# Altium project MotorControllerBoardV2.PrjPcb
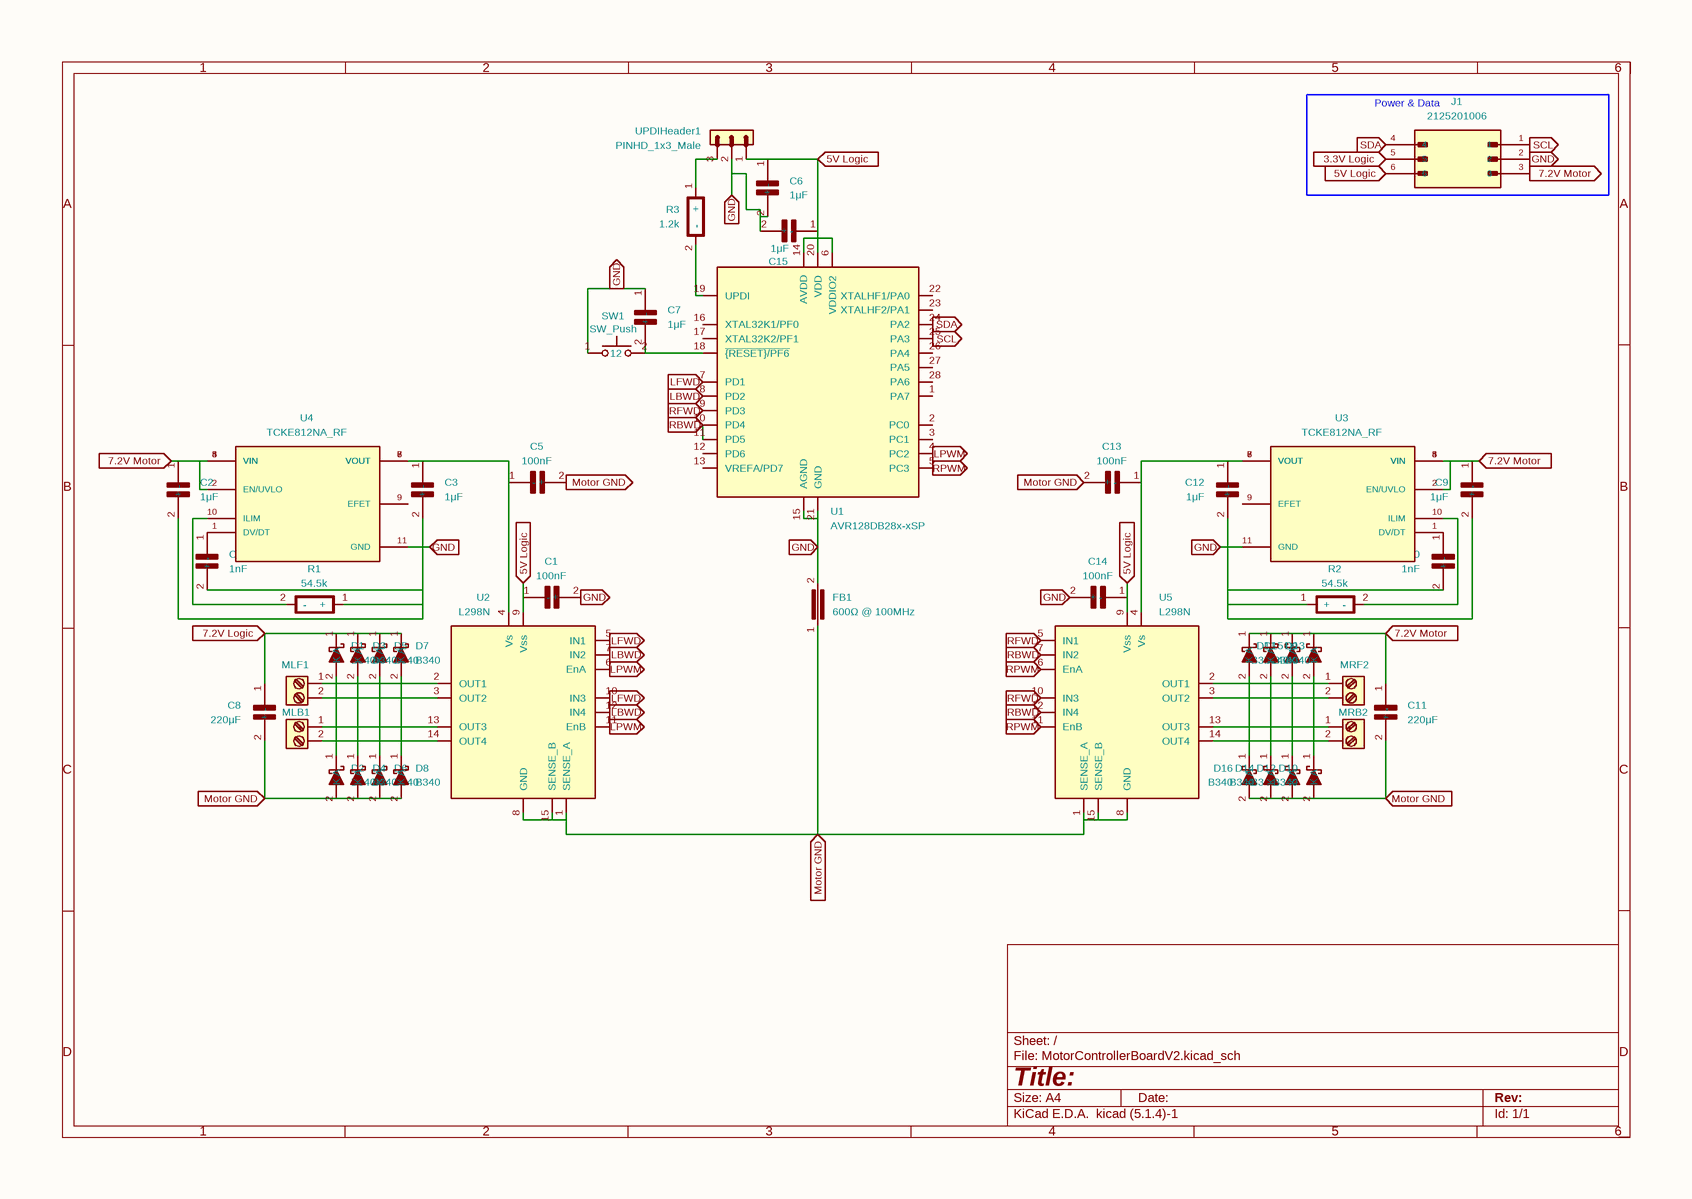
[diagram p0: MotorControllerBoardV2.SchDoc]
1 sheet, 47 parts. Net scope: flat (ports and power ports of the same name join across sheets).

## Sheet MotorControllerBoardV2.SchDoc
size 297 x 209 mm

### Parts
C1  100nF  [C_Disc_D3.0mm_W2.0mm_P2.50mm]
C2  1μF  [C_Disc_D3.0mm_W2.0mm_P2.50mm]
C3  1μF  [C_Disc_D3.0mm_W2.0mm_P2.50mm]
C4  1nF  [C_Disc_D3.0mm_W2.0mm_P2.50mm]
C5  100nF  [C_Disc_D3.0mm_W2.0mm_P2.50mm]
C6  1μF  [C_Disc_D3.0mm_W2.0mm_P2.50mm]
C7  1μF  [C_Disc_D3.0mm_W2.0mm_P2.50mm]
C8  220μF  [C_Disc_D3.0mm_W2.0mm_P2.50mm]
C9  1μF  [C_Disc_D3.0mm_W2.0mm_P2.50mm]
C10  1nF  [C_Disc_D3.0mm_W2.0mm_P2.50mm]
C11  220μF  [C_Disc_D3.0mm_W2.0mm_P2.50mm]
C12  1μF  [C_Disc_D3.0mm_W2.0mm_P2.50mm]
C13  100nF  [C_Disc_D3.0mm_W2.0mm_P2.50mm]
C14  100nF  [C_Disc_D3.0mm_W2.0mm_P2.50mm]
C15  1μF  [C_Disc_D3.0mm_W2.0mm_P2.50mm]
D1  B340  [D_SMA]
D2  B340  [D_SMA]
D3  B340  [D_SMA]
D4  B340  [D_SMA]
D5  B340  [D_SMA]
D6  B340  [D_SMA]
D7  B340  [D_SMA]
D8  B340  [D_SMA]
D9  B340  [D_SMA]
D10  B340  [D_SMA]
D11  B340  [D_SMA]
D12  B340  [D_SMA]
D13  B340  [D_SMA]
D14  B340  [D_SMA]
D15  B340  [D_SMA]
D16  B340  [D_SMA]
FB1  600Ω @ 100MHz  [LairdTech_28C0236-0JW-10]
J1  2125201006  [MOLEX_2125201006]
MLB1  Screw_Terminal_2_P5.00mm  [TerminalBlock_Phoenix_PT-1,5-2-5.0-H_1x02_P5.00mm_Horizontal]  (value not drawn)
MLF1  Screw_Terminal_2_P5.00mm  [TerminalBlock_Phoenix_PT-1,5-2-5.0-H_1x02_P5.00mm_Horizontal]  (value not drawn)
MRB2  Screw_Terminal_2_P5.00mm  [TerminalBlock_Phoenix_PT-1,5-2-5.0-H_1x02_P5.00mm_Horizontal]  (value not drawn)
MRF2  Screw_Terminal_2_P5.00mm  [TerminalBlock_Phoenix_PT-1,5-2-5.0-H_1x02_P5.00mm_Horizontal]  (value not drawn)
R1  54.5k  [R_Axial_DIN0207_L6.3mm_D2.5mm_P7.62mm_Horizontal]
R2  54.5k  [R_Axial_DIN0207_L6.3mm_D2.5mm_P7.62mm_Horizontal]
R3  1.2k  [R_Axial_DIN0207_L6.3mm_D2.5mm_P7.62mm_Horizontal]
SW1  SW_Push  [SW_PUSH_6mm]
U1  AVR128DB28x-xSP  [DIP-28_W7.62mm_Socket]
U2  L298N  [Multiwatt15L V with heatsink - Copy (1)]
U3  TCKE812NA_RF  [IC_TCKE812NA_RF]
U4  TCKE812NA_RF  [IC_TCKE812NA_RF]
U5  L298N  [Multiwatt15L V with heatsink - Copy (1)]
UPDIHeader1  PINHD_1x3_Male  [PinHeader_1x03_P2.54mm_Vertical]

### Blocks framed on the sheet
Power & Data /: J1

### Ports
3.3V Logic (in), 5V Logic (in), 7.2V Logic (in), 7.2V Motor (in), GND (in), LBWD (in), LFWD (in), LPWM (in), Motor GND (in), RBWD (in), RFWD (in), RPWM (in), SCL (in), SDA (in)

### Nets
3.3V Logic: J1.5 ; port 3.3V Logic
5V Logic: C1.1(+) C6.1(+) C14.1(+) C15.1(+) J1.6 U1.6(VDDIO2) U1.14(AVDD) U1.20(VDD) U2.9(Vss) U5.9(Vss) UPDIHeader1.1 ; port 5V Logic
7.2V Logic: C8.1(+) D1.1(K) D3.1(K) D5.1(K) D7.1(K) ; port 7.2V Logic
7.2V Motor: C2.1(+) C9.1(+) C11.1(+) D9.1(K) D11.1(K) D13.1(K) D15.1(K) J1.3 U3.2(EN/UVLO) U3.3(VIN) U3.4(VIN) U3.5(VIN) U4.2(EN/UVLO) U4.3(VIN) U4.4(VIN) U4.5(VIN) ; port 7.2V Motor
GND: C1.2(-) C2.2(-) C3.2(-) C4.2(-) C6.2(-) C7.1(+) C9.2(-) C10.2(-) C12.2(-) C14.2(-) C15.2(-) FB1.2 J1.2 R1.1(+) R2.1(+) SW1.1 U1.15(AGND) U1.21(GND) U3.11(GND) U4.11(GND) UPDIHeader1.2 ; port GND
LBWD: U1.8(PD2) U2.7(IN2) U2.12(IN4) ; port LBWD
LFWD: U1.7(PD1) U2.5(IN1) U2.10(IN3) ; port LFWD
LPWM: U1.4(PC2) U2.6(EnA) U2.11(EnB) ; port LPWM
Motor GND: C5.2(-) C8.2(-) C11.2(-) C13.2(-) D2.2(A) D4.2(A) D6.2(A) D8.2(A) D10.2(A) D12.2(A) D14.2(A) D16.2(A) FB1.1 U2.1(SENSE_A) U2.8(GND) U2.15(SENSE_B) U5.1(SENSE_A) U5.8(GND) U5.15(SENSE_B) ; port Motor GND
RBWD: U1.10(PD4) U1.11(PD5) U5.7(IN2) U5.12(IN4) ; port RBWD
RFWD: U1.9(PD3) U5.5(IN1) U5.10(IN3) ; port RFWD
RPWM: U1.5(PC3) U5.6(EnA) U5.11(EnB) ; port RPWM
SCL: J1.1 U1.25(PA3) ; port SCL
SDA: J1.4 U1.24(PA2) ; port SDA
NetC3_1: C3.1(+) C5.1(+) U2.4(Vs) U4.6(VOUT) U4.7(VOUT) U4.8(VOUT)
NetC4_1: C4.1(+) U4.1(DV/DT)
NetC7_2: C7.2(-) SW1.2 U1.18(~{{RESET}/PF6})
NetC10_1: C10.1(+) U3.1(DV/DT)
NetC12_1: C12.1(+) C13.1(+) U3.6(VOUT) U3.7(VOUT) U3.8(VOUT) U5.4(Vs)
NetD1_2: D1.2(A) D2.1(K) MLF1.1 U2.2(OUT1)
NetD3_2: D3.2(A) D4.1(K) MLF1.2 U2.3(OUT2)
NetD5_2: D5.2(A) D6.1(K) MLB1.1 U2.13(OUT3)
NetD7_2: D7.2(A) D8.1(K) MLB1.2 U2.14(OUT4)
NetD9_2: D9.2(A) D10.1(K) MRF2.1 U5.2(OUT1)
NetD11_2: D11.2(A) D12.1(K) MRF2.2 U5.3(OUT2)
NetD13_2: D13.2(A) D14.1(K) MRB2.1 U5.13(OUT3)
NetD15_2: D15.2(A) D16.1(K) MRB2.2 U5.14(OUT4)
NetR1_2: R1.2(-) U4.10(ILIM)
NetR2_2: R2.2(-) U3.10(ILIM)
NetR3_1: R3.1(+) UPDIHeader1.3
NetR3_2: R3.2(-) U1.19(UPDI)

Not connected (* = marked no-connect by the designer): U1 1(PA7) 2(PC0) 3(PC1) 12(PD6) 13(VREFA/PD7) 16(XTAL32K1/PF0) 17(XTAL32K2/PF1) 22(XTALHF1/PA0) 23(XTALHF2/PA1) 26(PA4) 27(PA5) 28(PA6); U3 9(EFET); U4 9(EFET)

### Notes on the sheet
- 1
- 2
- 3
- 4
- 5
- 6
- A
- B
- C
- D
- Title:
- File: MotorControllerBoardV2.kicad_sch
- Sheet: /
- KiCad E.D.A.  kicad (5.1.4)-1
- Size: A4
- Date:
- Rev:
- Id: 1/1

### Library data of the parts
C1-C15 = C: Description: capacitor, non-polarized/bipolar; Indicator: +; Rating: V; Footprint: Capacitor_THT:C_Disc_D3.0mm_W2.0mm_P2.50mm
  C1 C5 C13 C14: Value: 100nF
  C2 C3 C6 C7 C9 C12 C15: Value: 1μF
  C4 C10: Value: 1nF
  C8 C11: Value: 220μF
D1-D16 = B340: Description: SMC Schottky diode, 40V, 3A, Alternate KiCAD Library; Value: B340; Footprint: Diode_SMD:D_SMA
FB1 = Ferrite_Bead: Description: Ferrite bead, Alternate KiCAD Library; Value: 600Ω @ 100MHz; Footprint: Ferrite_THT:LairdTech_28C0236-0JW-10
J1 = 2125201006: MF: Molex; MP: 212520-1006; Description_1: \n                        \n                            MINI-FIT MAX 6 CIRCUIT HDR VERT | Molex Incorporated 212520-1006\n                        \n; DigiKey_Part_Number: 900-2125201006-ND; SnapEDA_Link: https://www.snapeda.com/parts/212520-1006/Molex/view-part/?ref=snap; MAXIMUM_PACKAGE_HEIGHT: 13.60mm; Package: None; Check_prices: https://www.snapeda.com/parts/212520-1006/Molex/view-part/?ref=eda; STANDARD: Manufacturer Recommendations; PARTREV: B1; MANUFACTURER: Molex; Value: 2125201006; Footprint: 2125201006:MOLEX_2125201006
R1-R3 = R: Description: resistor; Indicator: +; Rating: W; Footprint: Resistor_THT:R_Axial_DIN0207_L6.3mm_D2.5mm_P7.62mm_Horizontal
  R1 R2: Value: 54.5k
  R3: Value: 1.2k
SW1 = SW_Push: Description: Push button switch, generic, two pins; Value: SW_Push; Footprint: Button_Switch_THT:SW_PUSH_6mm
U1 = AVR128DB28x-xSP: Description: 24MHz, 128kB Flash, 16kB SRAM, EEPROM with Op Amps and Multi-Voltage I/O, SPDIP-28; Value: AVR128DB28x-xSP; Footprint: Package_DIP:DIP-28_W7.62mm_Socket
U2 U5 = L298N: Description: Dual full bridge motor driver, up to 46V, 4A, Multiwatt15-V; Value: L298N
U3 U4 = TCKE812NA_RF: MF: Toshiba Semiconductor and Storage; MP: TCKE812NA,RF; Description_1: \n                        \n                            Fuse IC with Adjustable Over Current Protection and Reverse Current Blocking FET Control\n                        \n; MAXIMUM_PACKAGE_HEIGHT: 0.75mm; Package: WFDFN-10 Toshiba Semiconductor and Storage; Price: None; Check_prices: https://www.snapeda.com/parts/TCKE812NA,RF/Toshiba/view-part/?ref=eda; STANDARD: Manufacturer Recommendations; PARTREV: 9.0; SnapEDA_Link: https://www.snapeda.com/parts/TCKE812NA,RF/Toshiba/view-part/?ref=snap; Availability: In Stock; MANUFACTURER: Toshiba Semiconductor and Storage; Value: TCKE812NA_RF; Footprint: TCKE812NA_RF:IC_TCKE812NA_RF
UPDIHeader1 = PINHD_1x3_Male: Description: Pin Header male with pin space 2.54mm. Pin Count -3; Value: PINHD_1x3_Male; Footprint: Connector_PinHeader_2.54mm:PinHeader_1x03_P2.54mm_Vertical
MLB1 MLF1 MRB2 MRF2 = Screw_Terminal_2_P5.00mm: Value: Screw_Terminal_2_P5.00mm; Footprint: TerminalBlock_Phoenix:TerminalBlock_Phoenix_PT-1,5-2-5.0-H_1x02_P5.00mm_Horizontal